# EAGLE design main (EAGLE 8.6.3)
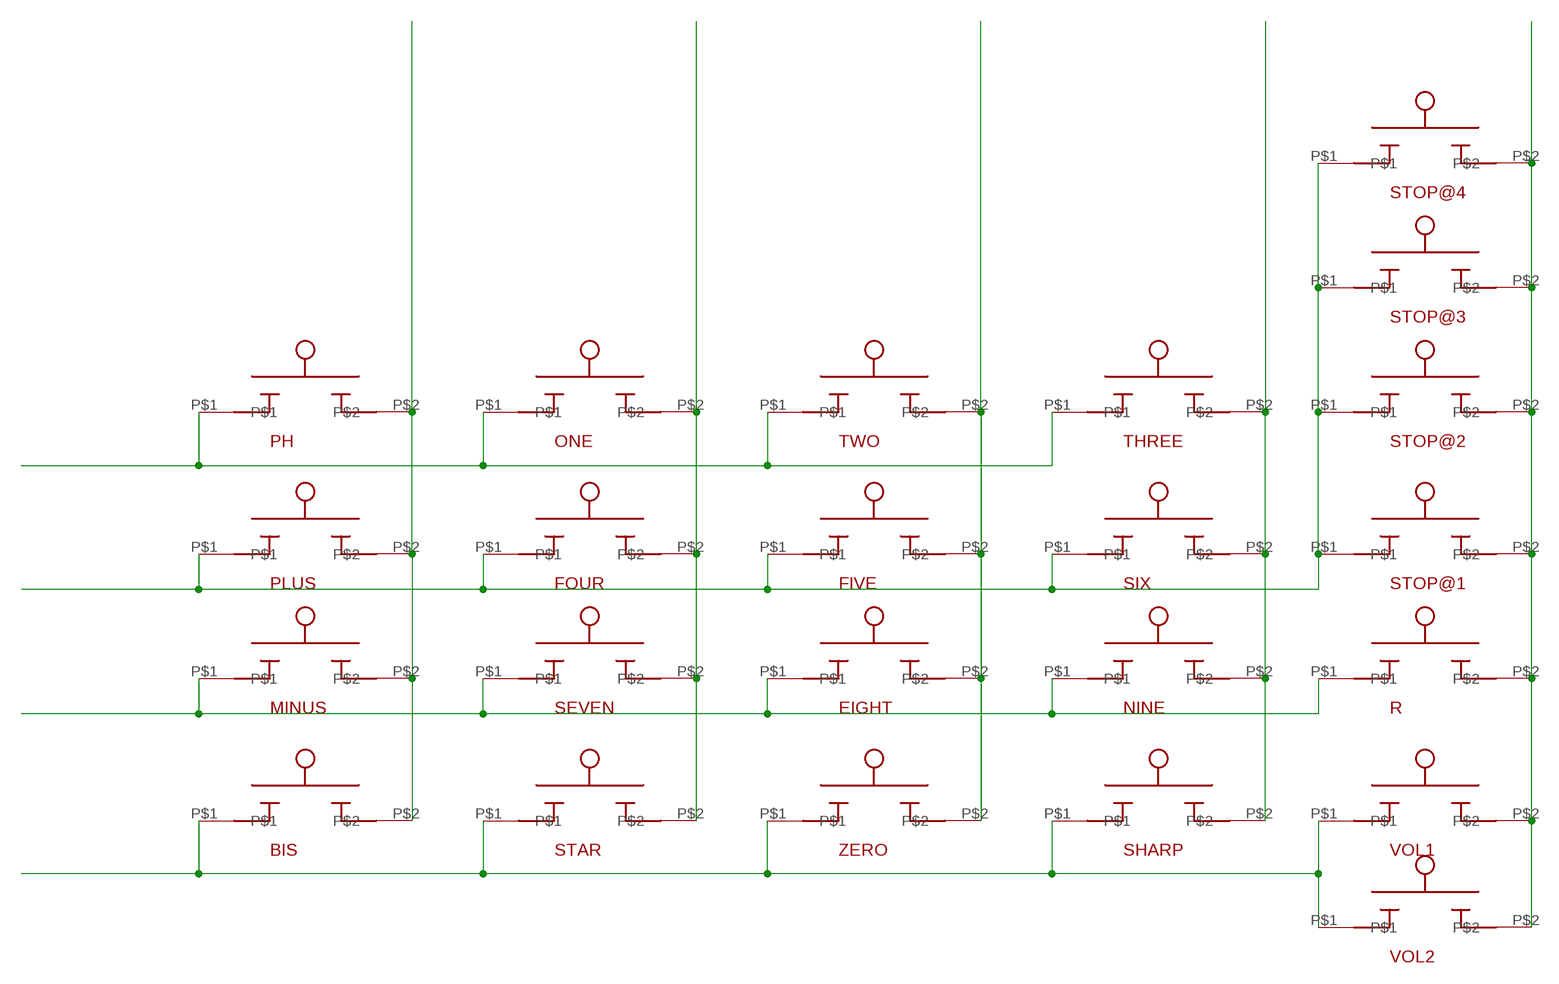
[diagram p0: schematic, sheet 1]

## Parts
BIS  MEMBRANE_BUTTON  [MEMBRANE_BUTTON]
EIGHT  MEMBRANE_BUTTON  [MEMBRANE_BUTTON]
FIVE  MEMBRANE_BUTTON  [MEMBRANE_BUTTON]
FOUR  MEMBRANE_BUTTON  [MEMBRANE_BUTTON]
MINUS  MEMBRANE_BUTTON  [MEMBRANE_BUTTON]
NINE  MEMBRANE_BUTTON  [MEMBRANE_BUTTON]
ONE  MEMBRANE_BUTTON  [MEMBRANE_BUTTON]
PH  MEMBRANE_BUTTON  [MEMBRANE_BUTTON]
PLUS  MEMBRANE_BUTTON  [MEMBRANE_BUTTON]
R  MEMBRANE_BUTTON  [MEMBRANE_BUTTON]
SEVEN  MEMBRANE_BUTTON  [MEMBRANE_BUTTON]
SHARP  MEMBRANE_BUTTON  [MEMBRANE_BUTTON]
SIX  MEMBRANE_BUTTON  [MEMBRANE_BUTTON]
STAR  MEMBRANE_BUTTON  [MEMBRANE_BUTTON]
STOP@1  MEMBRANE_BUTTON  [MEMBRANE_BUTTON]
STOP@2  MEMBRANE_BUTTON  [MEMBRANE_BUTTON]
STOP@3  MEMBRANE_BUTTON  [MEMBRANE_BUTTON]
STOP@4  MEMBRANE_BUTTON  [MEMBRANE_BUTTON]
THREE  MEMBRANE_BUTTON  [MEMBRANE_BUTTON]
TWO  MEMBRANE_BUTTON  [MEMBRANE_BUTTON]
VOL1  MEMBRANE_BUTTON  [MEMBRANE_BUTTON]
VOL2  MEMBRANE_BUTTON  [MEMBRANE_BUTTON]
ZERO  MEMBRANE_BUTTON  [MEMBRANE_BUTTON]

## Nets
N$1: ONE.P$1 PH.P$1 THREE.P$1 TWO.P$1
N$2: FIVE.P$1 FOUR.P$1 PLUS.P$1 SIX.P$1 STOP@1.P$1 STOP@2.P$1 STOP@3.P$1 STOP@4.P$1
N$3: EIGHT.P$1 MINUS.P$1 NINE.P$1 R.P$1 SEVEN.P$1
N$4: BIS.P$2 MINUS.P$2 PH.P$2 PLUS.P$2
N$5: FOUR.P$2 ONE.P$2 SEVEN.P$2 STAR.P$2
N$6: EIGHT.P$2 FIVE.P$2 TWO.P$2 ZERO.P$2
N$7: NINE.P$2 SHARP.P$2 SIX.P$2 THREE.P$2
N$8: R.P$2 STOP@1.P$2 STOP@2.P$2 STOP@3.P$2 STOP@4.P$2 VOL1.P$2 VOL2.P$2
N$9: BIS.P$1 SHARP.P$1 STAR.P$1 VOL1.P$1 VOL2.P$1 ZERO.P$1

## Library data of the parts
BIS EIGHT FIVE FOUR MINUS NINE ONE PH PLUS R SEVEN SHARP SIX STAR STOP@1-STOP@4 THREE TWO VOL1 VOL2 ZERO = 7_segment_lib:MEMBRANE_BUTTON

## Board
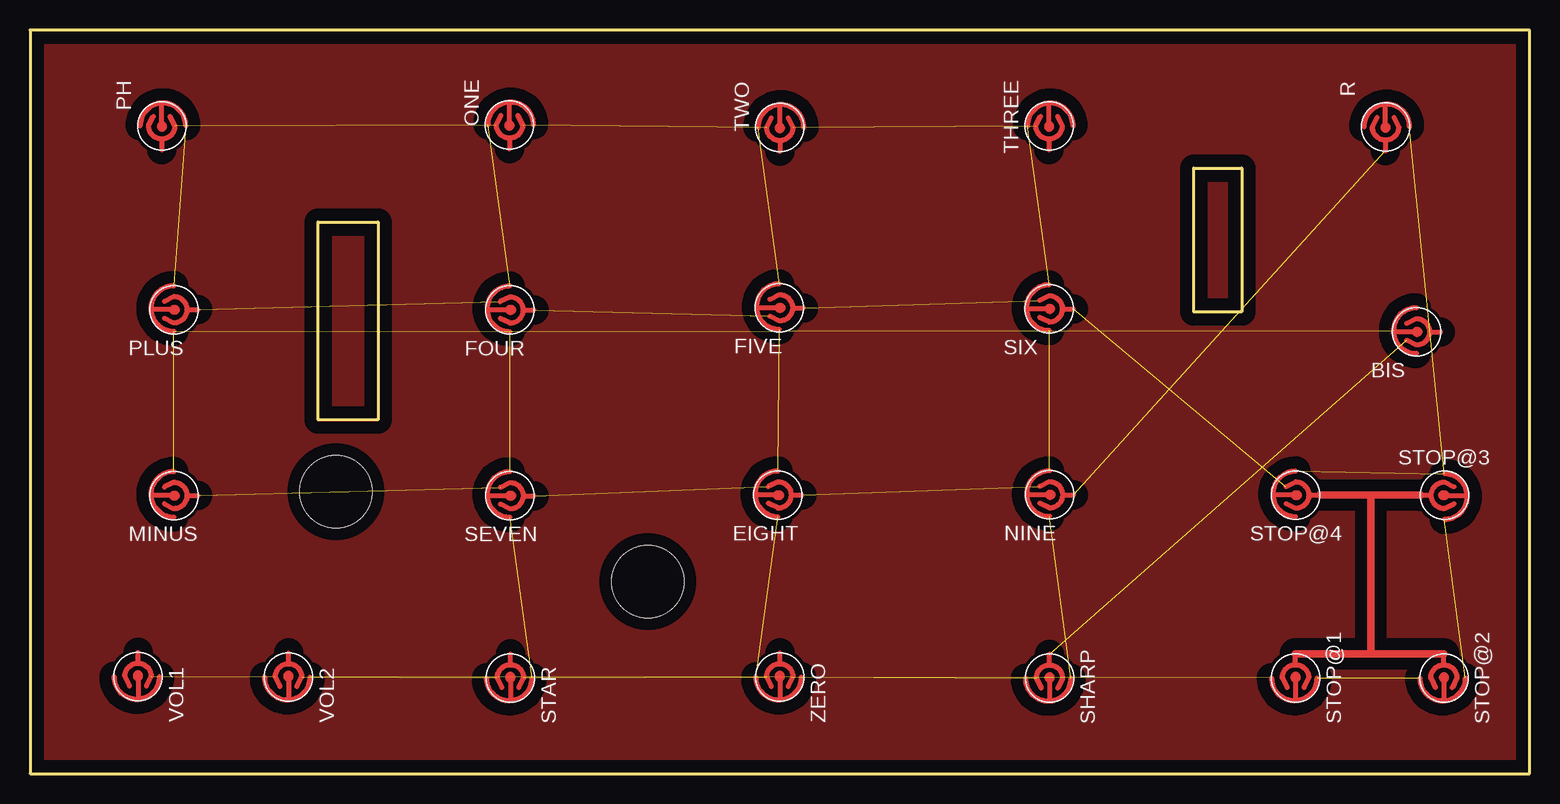
[diagram p1: board, top side]

Size 125 x 62 mm. Coordinates in mm from the lower left corner, seen from the top.
Outline: 0,0 125,0 125,62 0,62 0,0
Outline: 29,29.5 24,29.5 24,46 29,46 29,29.5
Outline: 101,38.5 97,38.5 97,50.5 101,50.5 101,38.5
Copper layers (1*16): Top 0.035mm / dielectric 1.5mm / Bottom 0.035mm
Design rules "default": minimum track width 6mil, minimum drill 0.35mm, track to track 6mil, track to pad 6mil, pad to pad 6mil, via to via 6mil, smd to smd 6mil, copper to edge 40mil, drill to drill 6mil, minimum pad ring 10mil, minimum via ring 8mil, stop-mask expansion 4mil, vias tented up to drill 0mil, thermal gap 10mil
Holes 6 mm at 51.5,16 25.5,23.5

### Footprints (pad centres in the part's own frame; a part is rotated, then mirrored left to right if it is on the bottom)
MEMBRANE_BUTTON = smd 0.1 x 0.1: P$1 2,0; P$2 0,2

### Placement (x,y rotation side)
BIS  115.57,36.83 0 top
EIGHT  62.35,23.23 0 top
FIVE  62.47,38.83 0 top
FOUR  40.01,38.65 0 top
MINUS  11.99,23.18 0 top
NINE  84.98,23.24 0 top
ONE  39.97,54.08 270 top
PH  10.98,54.01 270 top
PLUS  11.99,38.67 0 top
R  113,53.92 270 top
SEVEN  40.01,23.16 0 top
SHARP  84.98,7.94 90 top
SIX  84.96,38.74 0 top
STAR  40.05,7.98 90 top
STOP@1  105.5,7.98 90 top
STOP@2  117.86,7.96 90 top
STOP@3  117.9,23.2 180 top
STOP@4  105.51,23.21 0 top
THREE  84.95,54.01 270 top
TWO  62.5,53.88 270 top
VOL1  9,8.1 90 top
VOL2  21.55,8.05 90 top
ZERO  62.5,8.05 90 top

### Tracks (layer width: path | path; a pad name or v marks a point on that pad's centre or on a via)
GND
  pour Top (isolate 1.016): 0,62.23 125.73,62.23 125.73,0 0,0
N$1  (3 unrouted)
N$2  (4 unrouted)
  Top 0.61: STOP@2.P$1 117.86,9.98 111.76,9.98 | STOP@4.P$1 111.76,23.21 | 111.76,23.21 115.89,23.21 STOP@3.P$1 | 111.76,9.98 STOP@1.P$1 | 111.76,9.98 111.76,23.21
N$3  (4 unrouted)
N$4  (3 unrouted)
N$5  (3 unrouted)
N$6  (3 unrouted)
N$7  (3 unrouted)
N$8  (6 unrouted)
N$9  (5 unrouted)